# EAGLE schematic mv-scheme (EAGLE 9.5.1)
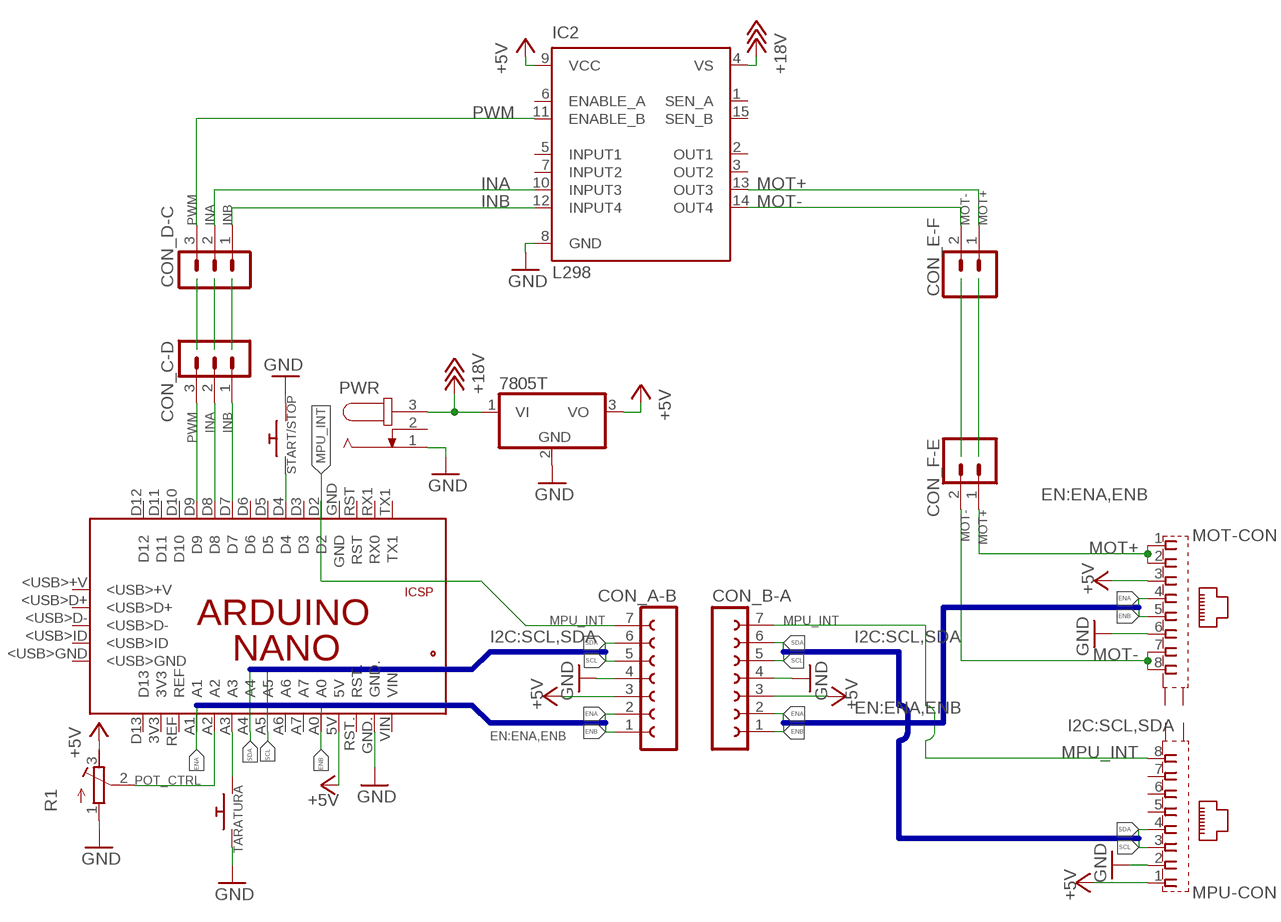
[diagram p0: schematic, sheet 1]

## Parts
CON_A-B  FE07W  [FE07W]
CON_B-A  FE07W  [FE07W]
CON_C-D  MA03-1  [MA03-1]
CON_D-C  MA03-1  [MA03-1]
CON_E-F  CONN_02  [1X02]
CON_F-E  CONN_02  [1X02]
IC1  7805T  [TO220H]
IC2  L298  [MULTIWATT-15]
MOT-CON  GLX-S-88M  [GLX-S-88M]
MPU-CON  GLX-S-88M  [GLX-S-88M]
PCB1  ARDUINO_NANO  [ARDUINO_NANO]
PWR  JACK-PLUG1  [SPC4078]
R1  R-TRIMM64W  [RTRIM64W]
START/STOP  SWITCH_PUSHBUTTONEVQ-PE  [TACT_PANA-EVQ]
TARATURA  SWITCH_PUSHBUTTONEVQ-PE  [TACT_PANA-EVQ]

## Nets
+5V: CON_A-B.3 CON_B-A.3 IC1.3(VO) IC2.9(VCC) MOT-CON.3 MPU-CON.1 PCB1.5V R1.3(E)
+18V: IC1.1(VI) IC2.4(VS) PWR.3
ENA: CON_A-B.2 CON_B-A.2 MOT-CON.4 PCB1.A1
ENB: CON_A-B.1 CON_B-A.1 MOT-CON.5 PCB1.A0
GND: CON_A-B.4 CON_B-A.4 IC1.2(GND) IC2.8(GND) MOT-CON.6 MPU-CON.2 PCB1.GND. PWR.1 R1.1(A) START/STOP.P$2 TARATURA.P$2
INA: CON_C-D.2 CON_D-C.2 IC2.10(INPUT3) PCB1.D8
INB: CON_C-D.1 CON_D-C.1 IC2.12(INPUT4) PCB1.D7
MOT+: CON_E-F.1 CON_F-E.1 IC2.13(OUT3) MOT-CON.1 MOT-CON.2
MOT-: CON_E-F.2 CON_F-E.2 IC2.14(OUT4) MOT-CON.7 MOT-CON.8
MPU_INT: CON_A-B.7 CON_B-A.7 MPU-CON.8 PCB1.D2
N$2: PCB1.A3 TARATURA.P$1
N$3: PCB1.D4 START/STOP.P$1
POT_CTRL: PCB1.A2 R1.2(S)
PWM: CON_C-D.3 CON_D-C.3 IC2.11(ENABLE_B) PCB1.D9
SCL: CON_A-B.5 CON_B-A.5 MPU-CON.3 PCB1.A5
SDA: CON_A-B.6 CON_B-A.6 MPU-CON.4 PCB1.A4
Unconnected: IC2.1(SEN_A) IC2.2(OUT1) IC2.3(OUT2) IC2.5(INPUT1) IC2.6(ENABLE_A) IC2.7(INPUT2) IC2.15(SEN_B) MOT-CON.S1 MOT-CON.S2 MPU-CON.5 MPU-CON.6 MPU-CON.7 MPU-CON.S1 MPU-CON.S2 PCB1.3V3 PCB1.5V. PCB1.<USB>+V PCB1.<USB>D+ PCB1.<USB>D- PCB1.<USB>GND PCB1.<USB>ID PCB1.A6 PCB1.A7 PCB1.D3 PCB1.D5 PCB1.D6 PCB1.D10 PCB1.D11 PCB1.D12 PCB1.D13 PCB1.GND PCB1.GND_ PCB1.MISO PCB1.MOSI PCB1.REF PCB1.RESET.. PCB1.RST PCB1.RST. PCB1.RX1(RX0) PCB1.SCK PCB1.TX1 PCB1.VIN PWR.2

## Buses
I2C:SCL,SDA
EN:ENA,ENB

## Library data of the parts
CON_A-B CON_B-A = con-lsta:FE07W: FEMALE HEADER; OC_FARNELL: unknown; OC_NEWARK: unknown
CON_C-D CON_D-C = con-lstb:MA03-1: PIN HEADER; OC_FARNELL: unknown; OC_NEWARK: unknown
CON_E-F CON_F-E = SparkFun-Connectors:CONN_02: Multi connection point. Often used as Generic Header-pin footprint for 0.1 inch spaced/style header connections On any of the 0.1 inch spaced packages, you can populate with these: Break Away Headers - Straight <https://www.sparkfun.com/products/116> (PRT-00116) Break Away Male Headers - Right Angle <https://www.sparkfun.com/products/553> (PRT-00553) Female Headers <https://www.sparkfun.com/products/115> (PRT-00115) Break Away Headers - Machine Pin <https://www.sparkfun.com/products/117> (PRT-00117) Break Away Female Headers - Swiss Machine Pin <https://www.sparkfun.com/products/743> (PRT-00743) For SCREWTERMINALS and SPRING TERMINALS visit here: Screw Terimnals on SparkFun.com <https://www.sparkfun.com/search/results?term=Screw+Terminals> (5mm/3.5mm/2.54mm spacing) This device is also useful as a general connection point to wire up your design to another part of your project. Our various solder wires solder well into these plated through hole pads. Hook-Up Wire - Assortment (Stranded, 22 AWG) <https://www.sparkfun.com/products/11375> (PRT-11375) Hook-Up Wire - Assortment (Solid Core, 22 AWG) <https://www.sparkfun.com/products/11367> (PRT-11367) View the entire wire category on our website here <https://www.sparkfun.com/categories/141> Special notes: Molex polarized connector foot print use with: PRT-08233 with associated crimp pins and housings. 2.54_SCREWTERM for use with PRT-10571. 3.5mm Screw Terminal footprints for PRT-08084 5mm Screw Terminal footprints for use with PRT-08432
IC1 = adafruit:78*: Positive VOLTAGE REGULATOR Added bigger pads to the TO-92 package
IC2 = st-microelectronics:L298: DUAL FULL-BRIDGE DRIVER; MPN: L298N; OC_FARNELL: 1589425; OC_NEWARK: 32M1527
MOT-CON MPU-CON = con-kycon:GLX-S-88M: Mod. Jack, Right Angle, 8 posiotion, 8 contatcs RJ45 Source: GLX-S-88M.pdf; OC_FARNELL: unknown; OC_NEWARK: unknown
PCB1 = E14_Arduino:ARDUINO_NANO: Device for representing an Arduino Nano board with a footprint in an EAGLE design. Created by Dave Young for Element14. More EAGLE documentation at: http://www.element14.com/community/community/knode/cadsoft_eagle
PWR = con-jack:JACK-PLUG: DC POWER JACK Power Jack, DC, Right Angle, Through Hole, Rated 5A at 16VDC, PC Terminals Distributor: Farnell (www.Farnell.de) Drawing: 84N1161.pdf / 84N1162.pdf Manufacturer: SPC Technology (www.spctechnology.com) Type: SPC4077 / SPC 4078; OC_FARNELL: unknown; OC_NEWARK: unknown
R1 = rcl:R-TRIMM: Trimm resistor; SPICEMODEL: X; SPICEPREFIXL: POT
START/STOP TARATURA = adafruit:SWITCH_PUSHBUTTON: Buttons SOFTTOUCHSMD_SJ - Soft touch temporary push button (Super Junk Akihabara) Compatible with SKPMANE010 [Mouser: 688-SKPMAN] C&K_KSS = Digikey: KSS221GLFS